# Altium schematic sheet USB2UART.SchDoc
size A4
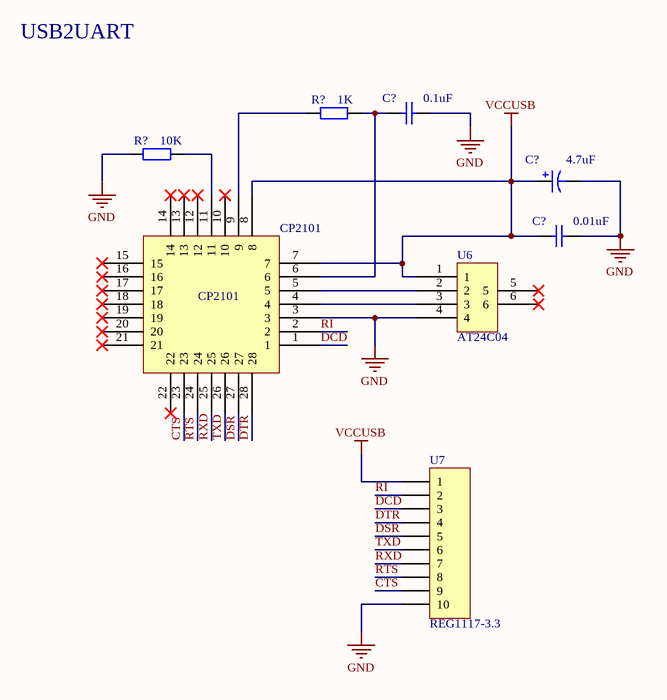
[diagram p0: USB2UART.SchDoc]

## Parts
(Parts that share a designator on the sheet are numbered #1, #2 ... from top to bottom, then left to right.)
1  CP2101  [QFN50P500X500-28W1N]
C?#1  value 0.1uF  [1608[0603]]  (hidden comment: Cap)
C?#2  value 4.7uF  [1608[0603] - POL]  (hidden comment: CAP POL)
C?#3  value 0.01uF  [1608[0603]]  (hidden comment: Cap)
R?#1  value 1K  [1608[0603]]  (hidden comment: Res)
R?#2  value 10K  [1608[0603]]  (hidden comment: Res)
U6  AT24C04
U7  REG1117-3.3  [SOT223]

## Nets
GND: 1.3 C?#1.2 C?#2.2 C?#3.2 R?#2.1 U6.4 U7.10
VCCUSB: 1.7 1.8 C?#2.1 C?#3.1 U6.1 U7.1
CTS: 1.23 U7.9
DCD: 1.1 U7.3
DSR: 1.27 U7.5
DTR: 1.28 U7.4
RI: 1.2 U7.2
RTS: 1.24 U7.8
RXD: 1.25 U7.7
TXD: 1.26 U7.6
Net1_4: 1.4 U6.3
Net1_5: 1.5 U6.2
Net1_6: 1.6 C?#1.1 R?#1.2
Net1_9: 1.9 R?#1.1
Net1_11: 1.11 R?#2.2

Not connected (* = marked no-connect by the designer): 1 10* 12* 13* 14* 15* 16* 17* 18* 19* 20* 21* 22*; U6 5* 6*

## Notes on the sheet
- USB2UART

## Library data of the parts
1 = Component_1
C?#1 C?#3 = Cap: Capacitor; Published: 8-Jun-2000; LatestRevisionDate: 17-Jul-2002; LatestRevisionNote: Re-released for DXP Platform.; Publisher: Altium Limited
C?#2 = CAP POL: Polarized Capacitor (Axial); Published: 8-Jun-2000; LatestRevisionDate: 17-Jul-2002; LatestRevisionNote: Re-released for DXP Platform.; Publisher: Altium Limited
R?#1 R?#2 = RES: Resistor; Published: 8-Jun-2000; LatestRevisionDate: 17-Jul-2002; LatestRevisionNote: Re-released for DXP Platform.; Publisher: Altium Limited
U6 = USB
U7 = Header 10: Header, 10-Pin; LatestRevisionDate: 17-Jul-2002; LatestRevisionNote: Re-released for DXP Platform.; Publisher: Altium Limited